# Altium project Filter_Bank_EVB.PrjPcb
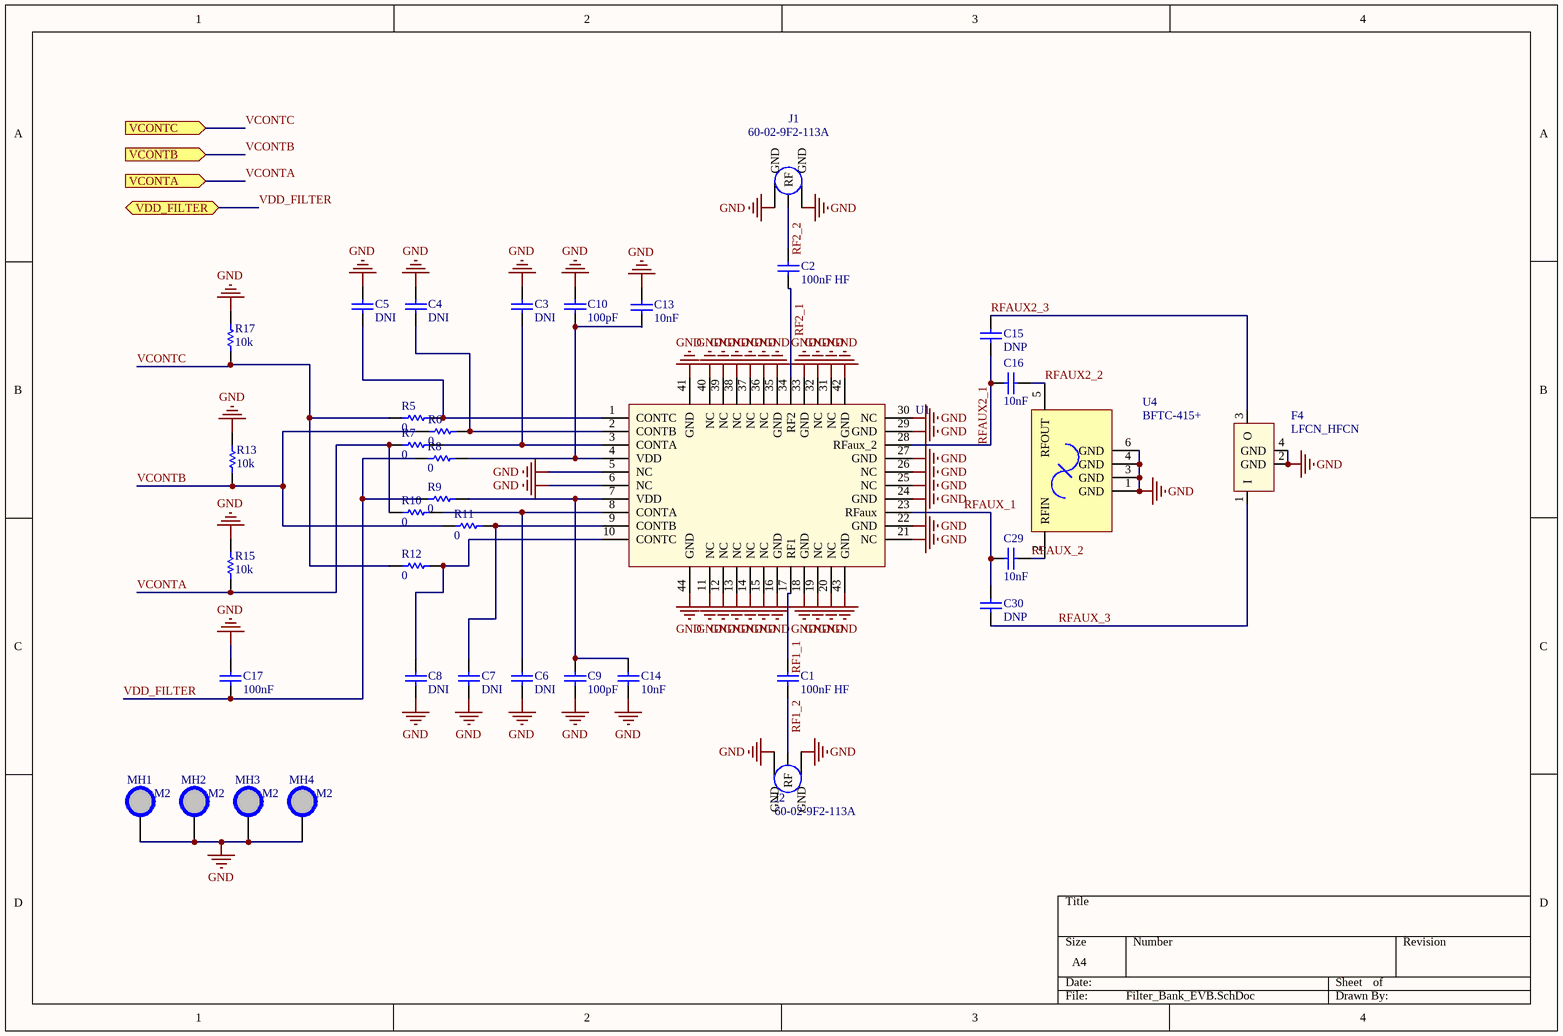
[diagram p0: Filter_Bank_EVB.SchDoc]
1 sheet, 37 parts. Net scope: flat (ports and power ports of the same name join across sheets).
Board files: Filter_Bank_EVB.PcbDoc, PCB1.PcbDoc, dim.PcbDoc, PCB2.PcbDoc

## Sheet Filter_Bank_EVB.SchDoc
size A4

### Parts
C1  value 100nF HF  [C0402]  (hidden comment: CAP)
C2  value 100nF HF  [C0402]  (hidden comment: CAP)
C3  value DNI  [C0402]  (hidden comment: CAP)
C4  value DNI  [C0402]  (hidden comment: CAP)
C5  value DNI  [C0402]  (hidden comment: CAP)
C6  value DNI  [C0402]  (hidden comment: CAP)
C7  value DNI  [C0402]  (hidden comment: CAP)
C8  value DNI  [C0402]  (hidden comment: CAP)
C9  value 100pF  [C0402]  (hidden comment: CAP)
C10  value 100pF  [C0402]  (hidden comment: CAP)
C13  value 10nF  [C0402]  (hidden comment: CAP)
C14  value 10nF  [C0402]  (hidden comment: CAP)
C15  value DNP  [C0402]  (hidden comment: CAP)
C16  value 10nF  [C0402]  (hidden comment: CAP)
C17  value 100nF  [C0402]  (hidden comment: CAP)
C29  value 10nF  [C0402]  (hidden comment: CAP)
C30  value DNP  [C0402]  (hidden comment: CAP)
F4  LFCN_HFCN  [FV1206]
J1  60-02-9F2-113A  [60-02-9F2-113A]
J2  60-02-9F2-113A  [60-02-9F2-113A]
MH1  M2  [M2]
MH2  M2  [M2]
MH3  M2  [M2]
MH4  M2  [M2]
R5  value 0  [R0402]  (hidden comment: RES)
R6  value 0  [R0402]  (hidden comment: RES)
R7  value 0  [R0402]  (hidden comment: RES)
R8  value 0  [R0402]  (hidden comment: RES)
R9  value 0  [R0402]  (hidden comment: RES)
R10  value 0  [R0402]  (hidden comment: RES)
R11  value 0  [R0402]  (hidden comment: RES)
R12  value 0  [R0402]  (hidden comment: RES)
R13  value 10k  [R0402]  (hidden comment: RES)
R15  value 10k  [R0402]  (hidden comment: RES)
R17  value 10k  [R0402]  (hidden comment: RES)
U1  Bypass LNA  [40L-QFN-6X6-50P-MOD]  (value not drawn)
U4  BFTC-415+  [BFTC-415+]

### Ports
VCONTA (in), VCONTB (in), VCONTC (in), VDD_FILTER (bidir)

### Nets
GND: C3.2 C4.2 C5.2 C6.1 C7.1 C8.1 C9.1 C10.2 C13.1 C14.1 C17.2 F4.2(GND) F4.4(GND) J1.2(GND) J2.2(GND) MH1.1 MH2.1 MH3.1 MH4.1 R13.2 R15.2 R17.2 U1.5(NC) U1.6(NC) U1.11(NC) U1.12(NC) U1.13(NC) U1.14(NC) U1.15(NC) U1.16(GND) U1.18(GND) U1.19(NC) U1.20(NC) U1.21(NC) U1.22(GND) U1.24(GND) U1.25(NC) U1.26(NC) U1.27(GND) U1.29(GND) U1.30(NC) U1.31(NC) U1.32(NC) U1.33(GND) U1.35(GND) U1.36(NC) U1.37(NC) U1.38(NC) U1.39(NC) U1.40(NC) U1.41(GND) U1.42(GND) U1.43(GND) U1.44(GND) U4.1(GND) U4.3(GND) U4.4(GND) U4.6(GND)
RF1_1: C1.2 U1.17(RF1)
RF1_2: C1.1 J2.1(RF)
RF2_1: C2.1 U1.34(RF2)
RF2_2: C2.2 J1.1(RF)
RFAUX2_1: C15.2 C16.2 U1.28(RFaux_2)
RFAUX2_2: C16.1 U4.5(RFOUT)
RFAUX2_3: C15.1 F4.3(O)
RFAUX_1: C29.2 C30.1 U1.23(RFaux)
RFAUX_2: C29.1 U4.2(RFIN)
RFAUX_3: C30.2 F4.1(I)
VCONTA: R7.1 R10.1 R15.1 ; port VCONTA
VCONTB: R6.1 R11.1 R13.1 ; port VCONTB
VCONTC: R5.1 R12.1 R17.1 ; port VCONTC
VDD_FILTER: C17.1 R8.1 R9.1 ; port VDD_FILTER
NetC3_1: C3.1 R7.2 U1.3(CONTA)
NetC4_1: C4.1 R6.2 U1.2(CONTB)
NetC5_1: C5.1 R5.2 U1.1(CONTC)
NetC6_2: C6.2 R10.2 U1.8(CONTA)
NetC7_2: C7.2 R11.2 U1.9(CONTB)
NetC8_2: C8.2 R12.2 U1.10(CONTC)
NetC9_2: C9.2 C14.2 R9.2 U1.7(VDD)
NetC10_1: C10.1 C13.2 R8.2 U1.4(VDD)

### Library data of the parts
C1-C10 C13-C17 C29 C30 = CAP: Capacitor
R5-R13 R15 R17 = RES: Resistor
U1 = Filter_Bank: Value: *